# EAGLE schematic HHK-Bluetooth (EAGLE 6.5.0)
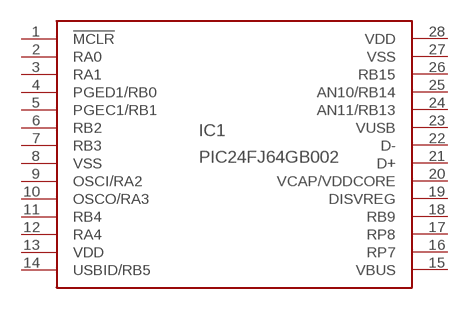
[diagram p0: schematic, sheet 1]

## Parts
IC1  PIC24FJ64GB002  [DIL28-3]
Unconnected: IC1.1(!MCLR) IC1.2(RA0) IC1.3(RA1) IC1.4(PGED1/RB0) IC1.5(PGEC1/RB1) IC1.6(RB2) IC1.7(RB3) IC1.9(OSCI/RA2) IC1.10(OSCO/RA3) IC1.11(RB4) IC1.12(RA4) IC1.14(USBID/RB5) IC1.15(VBUS) IC1.16(RP7) IC1.17(RP8) IC1.18(RB9) IC1.19(DISVREG) IC1.21(D+) IC1.22(D-) IC1.23(VUSB) IC1.24(AN11/RB13) IC1.25(AN10/RB14) IC1.26(RB15)

## Power pins joined to a net without a drawn wire
VCAP/VDDCORE: IC1.20(VCAP/VDDCORE)
VDD: IC1.13(VDD) IC1.28(VDD)
VSS: IC1.8(VSS) IC1.27(VSS)

## Library data of the parts
IC1 = HHK-Bluetooth:PIC24FJ64GB002: PIC24FJ64GB002; MPN: PIC24FJ64GB002-I/SP; OC_FARNELL: 1332298; OC_NEWARK: 88K6132